# EAGLE schematic 15V Power Supply (EAGLE 9.1.1)
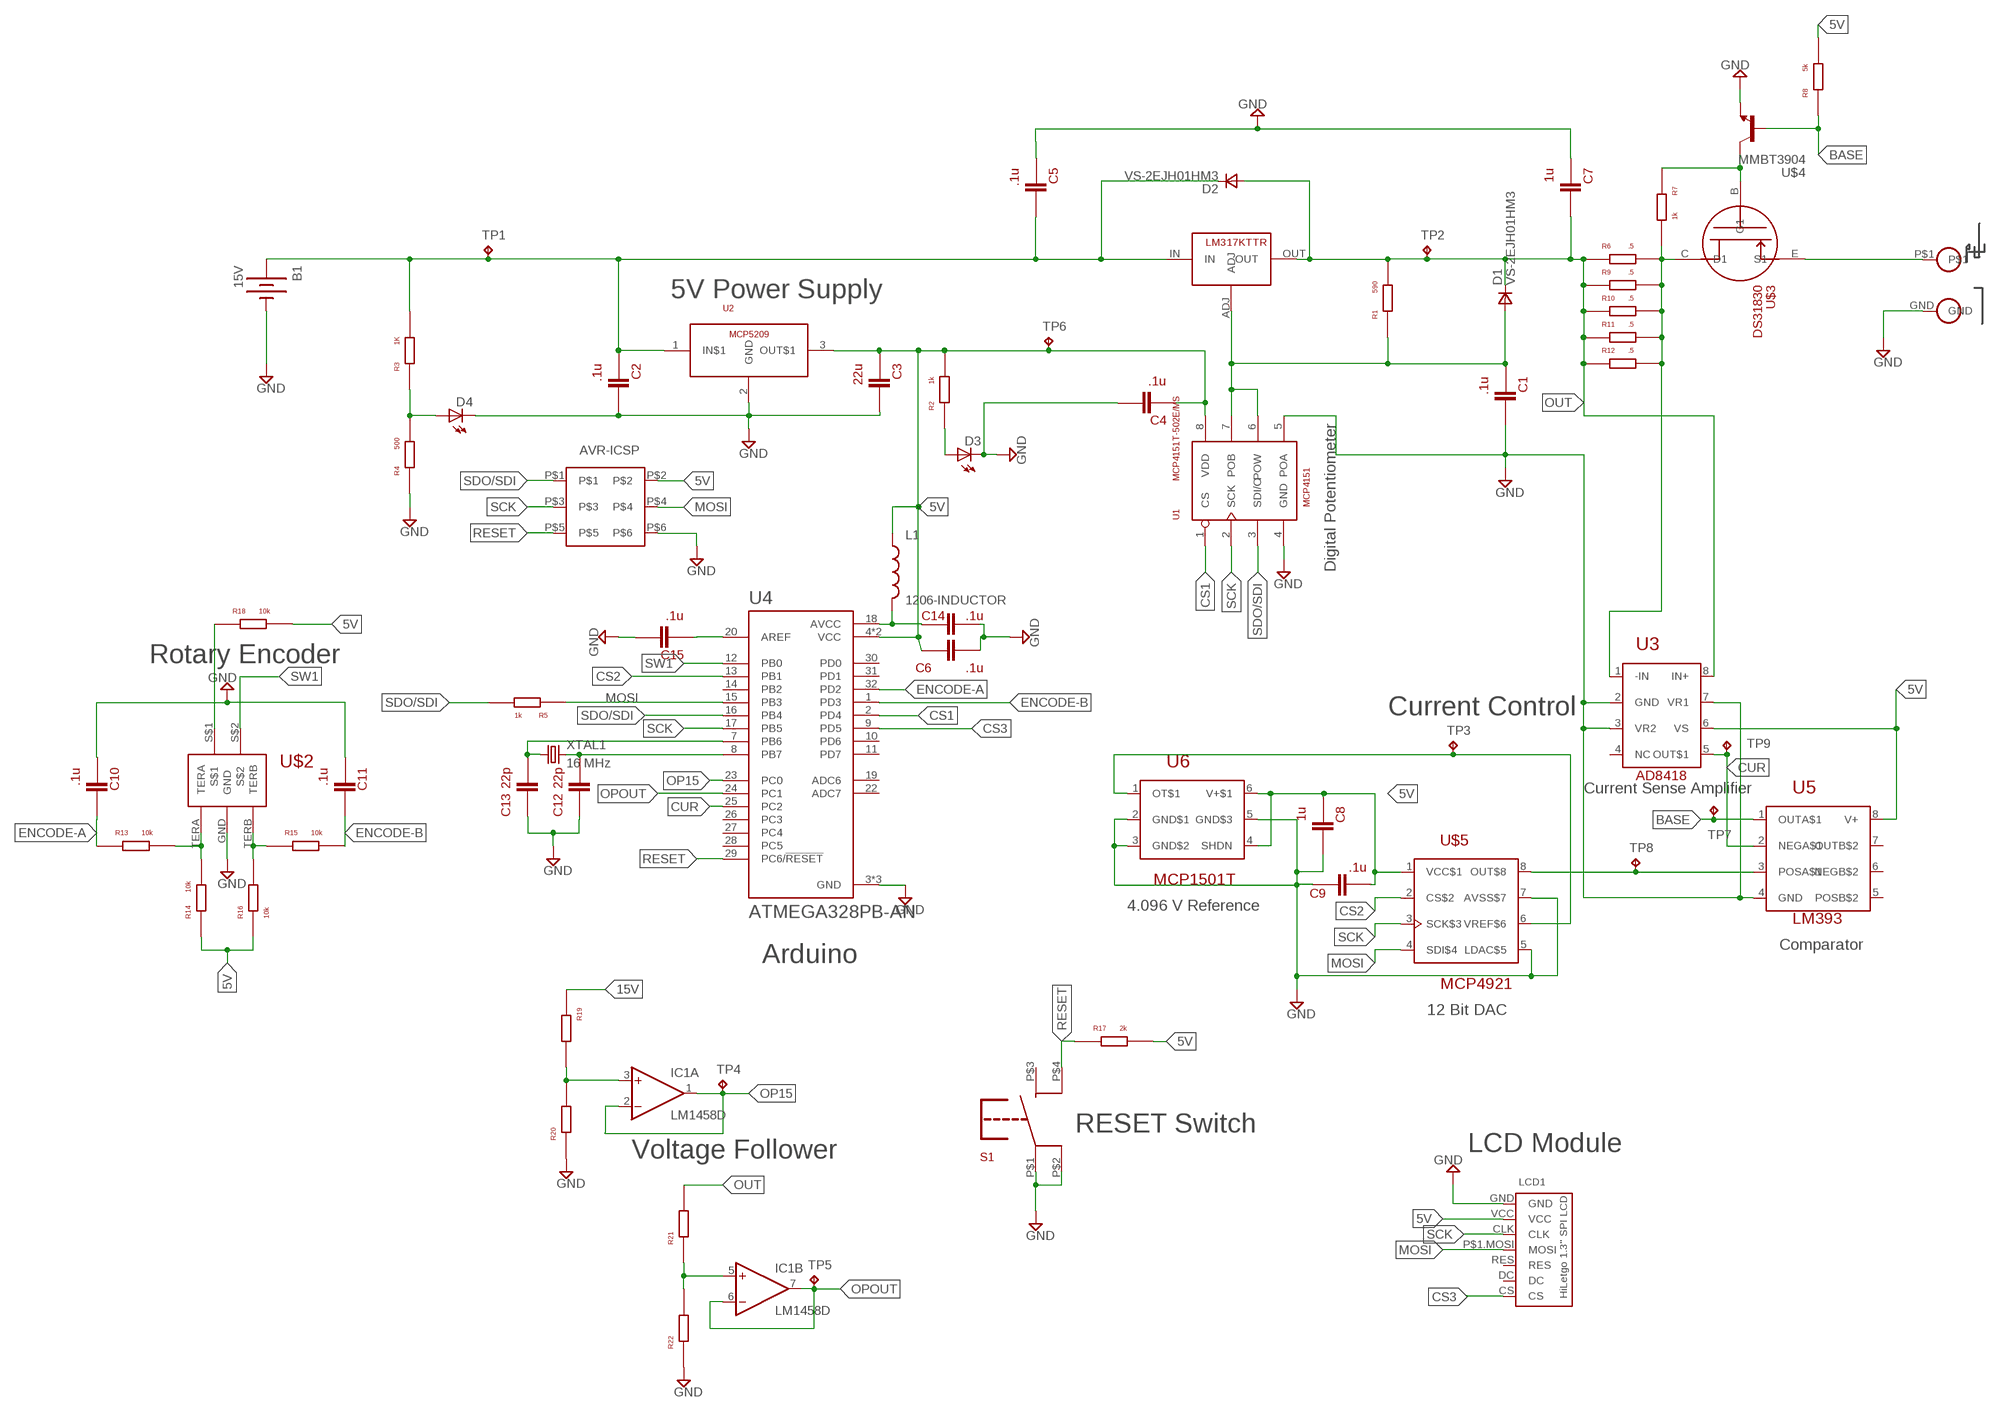
[diagram p0: schematic, sheet 1]

## Parts
B1  15V  2.1BARRELJACK  [2.1BARRELJACK]
C1  .1u  1206LED  [1206CAP]
C2  .1u  1206LED  [1206CAP]
C3  22u  1206LED  [1206CAP]
C4  .1u  1206LED  [1206CAP]
C5  .1u  1206LED  [1206CAP]
C6  .1u  1206LED  [1206CAP]
C7  1u  1206LED  [1206CAP]
C8  1u  1206LED  [1206CAP]
C9  .1u  1206LED  [1206CAP]
C10  .1u  1206LED  [1206CAP]
C11  .1u  1206LED  [1206CAP]
C12  22p  1206LED  [1206CAP]
C13  22p  1206LED  [1206CAP]
C14  .1u  1206LED  [1206CAP]
C15  .1u  1206LED  [1206CAP]
D1  VS-2EJH01HM3  [DO-221AC-2]
D2  VS-2EJH01HM3  [DO-221AC-2]
D3  1206LEDDIODE  [1206]
D4  1206LEDDIODE  [1206]
IC1  LM1458D  [SO08]
L1  1206-INDUCTOR  [1206]
LCD1  HILETGOSPILCD  [HILETGOSPILCD]
R1  590  1206RESISTOR  [1206]
R2  1k  1206RESISTOR  [1206]
R3  1K  1206RESISTOR  [1206]
R4  500  1206RESISTOR  [1206]
R5  1k  1206RESISTOR  [1206]
R6  .5  1206RESISTOR  [1206]
R7  1k  1206RESISTOR  [1206]
R8  5k  1206RESISTOR  [1206]
R9  .5  1206RESISTOR  [1206]
R10  .5  1206RESISTOR  [1206]
R11  .5  1206RESISTOR  [1206]
R12  .5  1206RESISTOR  [1206]
R13  10k  1206RESISTOR  [1206]
R14  10k  1206RESISTOR  [1206]
R15  10k  1206RESISTOR  [1206]
R16  10k  1206RESISTOR  [1206]
R17  2k  1206RESISTOR  [1206]
R18  10k  1206RESISTOR  [1206]
R19  1206RESISTOR  [1206]
R20  1206RESISTOR  [1206]
R21  1206RESISTOR  [1206]
R22  1206RESISTOR  [1206]
S1  TL3305  [TL3305]
TP1  TPTP11R  [TP11R]
TP2  TPTP11R  [TP11R]
TP3  TPTP11R  [TP11R]
TP4  TPTP11R  [TP11R]
TP5  TPTP11R  [TP11R]
TP6  TPTP11R  [TP11R]
TP7  TPPAD1-13  [P1-13]
TP8  TPB1,27  [B1,27]
TP9  TPB1,27  [B1,27]
U1  MCP4151T-502E/MS  [DGK_S-PDSO-G8]
U2  MCP5209-5.0YS  [SOT223]
U3  AD8418BZR  [DGK_S-PDSO-G8]
U4  ATMEGA328PB-AN  [QFP80P900X900X120-32N]
U5  LM393  [SO8]
U6  MCP1501T-40E/CHY  [SOT23-6]
U$1  LM317KTTR  [LM317KTTR]
U$2  PEC11R  [PEC11R-4]
U$3  DS31830  [SC59-EBC]
U$4  MMBT3904  [SC59-EBC]
U$5  MCP4921-E/SN  [SO8]
U$6  ICSP-HEADER  [ISCP-PORT]
U$7  BINDINGPOST  [CT2232]
XTAL1  16 MHz  16MHZ-CRYSTAL  [HC/49US]

## Nets
5V: C3.P$2 C4.P$2 C6.P$1 C8.P$2 C9.P$1 L1.P$1 LCD1.VCC R2.P$1 R8.P$1 R14.P$2 R16.P$2 R17.P$1 R18.P$1 TP6.TP U1.8(VDD) U2.3(OUT$1) U3.6(VS) U4.4(VCC) U4.6(VCC) U5.8(V+) U6.4(SHDN) U6.6(V+$1) U$5.1(VCC$1) U$6.P$2
15V: B1.POS C2.P$2 C5.P$1 D2.C$1(C) R3.P$1 R19.P$2 TP1.TP U2.1(IN$1) U$1.IN
BASE: R8.P$2 TP7.TP U5.1(OUTA$1) U$4.B
CS1: U1.1(CS) U4.2(PD4)
CS2: U4.13(PB1) U$5.2(CS$2)
CS3: LCD1.CS U4.9(PD5)
CUR: TP9.TP U3.5(OUT$1) U4.25(PC2) U5.2(NEGA$1)
ENCODE-A: C10.P$1 R13.P$2 U4.32(PD2)
ENCODE-B: C11.P$1 R15.P$1 U4.1(PD3)
GND: B1.GND$1(GND) C1.P$1 C2.P$1 C3.P$1 C4.P$1 C5.P$2 C6.P$2 C7.P$2 C8.P$1 C9.P$2 C10.P$2 C11.P$2 C12.P$1 C13.P$1 C14.P$2 C15.P$1 D3.P$2(C) D4.P$2(C) LCD1.GND R4.P$2 R20.P$2 R22.P$2 S1.P$1 S1.P$2 U1.4(GND) U1.5(POA) U2.2(GND) U3.2(GND) U3.3(VR2) U3.7(VR1) U4.3(GND) U4.5(GND) U4.21(GND) U5.4(GND) U6.2(GND$1) U6.3(GND$2) U6.5(GND$3) U$2.GND U$4.E U$5.5(LDAC$5) U$5.7(AVSS$7) U$6.P$6 U$7.GND
MOSI: LCD1.P$1.MOSI(MOSI) R5.P$2 U4.15(PB3) U$5.4(SDI$4) U$6.P$4
N$1: D4.P$1(A) R3.P$2 R4.P$1
N$2: U$3.E(S1) U$7.P$1
N$3: C1.P$2 D1.A$1(A) R1.P$2 U1.6(POW) U1.7(POB) U$1.ADJ
N$4: TP3.TP U6.1(OT$1) U$5.6(VREF$6)
N$6: D3.P$1(A) R2.P$2
N$7: C14.P$1 L1.P$2 U4.18(AVCC)
N$8: C13.P$2 U4.7(PB6) XTAL1.P$1
N$9: TP8.TP U5.3(POSA$1) U$5.8(OUT$8)
N$10: R6.P$1 R7.P$1 R9.P$1 R10.P$1 R11.P$1 R12.P$1 U3.1(-IN) U$3.C(D1)
N$11: R13.P$1 R14.P$1 U$2.TERA
N$12: R15.P$2 R16.P$1 U$2.TERB
N$13: C12.P$2 U4.8(PB7) XTAL1.P$2
N$14: R7.P$2 U$3.B(G1) U$4.C
N$16: C15.P$2 U4.20(AREF)
N$18: R18.P$2 U$2.S$1
N$20: IC1.3(A:+IN) R19.P$1 R20.P$1
N$22: IC1.5(B:+IN) R21.P$2 R22.P$1
OP15: IC1.1(A:OUT) IC1.2(A:-IN) TP4.TP U4.23(PC0)
OPOUT: IC1.6(B:-IN) IC1.7(B:OUT) TP5.TP U4.24(PC1)
OUT: C7.P$1 D1.C$1(C) D2.A$1(A) R1.P$1 R6.P$2 R9.P$2 R10.P$2 R11.P$2 R12.P$2 R21.P$1 TP2.TP U3.8(IN+) U$1.OUT
RESET: R17.P$2 S1.P$4 U4.29(PC6/!RESET) U$6.P$5
SCK: LCD1.CLK U1.2(SCK) U4.17(PB5) U$5.3(SCK$3) U$6.P$3
SDO/SDI: R5.P$1 U1.3(SDI/O) U4.16(PB4) U$6.P$1
SW1: U4.12(PB0) U$2.S$2
Unconnected: LCD1.DC LCD1.RES S1.P$3 U3.4(NC) U4.10(PD6) U4.11(PD7) U4.14(PB2) U4.19(ADC6) U4.22(ADC7) U4.26(PC3) U4.27(PC4) U4.28(PC5) U4.30(PD0) U4.31(PD1) U5.5(POSB$2) U5.6(NEGB$2) U5.7(OUTB$2)

## Notes on the sheet
- 5V Power Supply
- Digital Potentiometer
- Rotary Encoder
- Current Control
- Current Sense Amplifier
- 4.096 V Reference
- Comparator
- Arduino
- 12 Bit DAC
- RESET Switch
- Voltage Follower | LCD Module

## Power pins joined to a net without a drawn wire
V+: IC1.8(P:V+)
V-: IC1.4(P:V-)

## Library data of the parts
B1 = Booster Parts:2.1BARRELJACK: 2.1 mm x 5.5 mm Barrel Jack Specifications: Manufacturer: Memory Protection Devices Voltage - Rated: 12 VDC Current Rating: 5A Datasheet: EJ508A <http://www.memoryprotectiondevices.com/datasheets/EJ508A-datasheet.pdf> Digikey Part #: EJ508A-ND <https://www.digikey.com/products/en?keywords=EJ508A>
C1-C15 = 1206CAP:1206LED
D1 D2 = LM317:VS-2EJH01HM3: Vishay VS-3EJH01HM3/6A: 100V 3A Diode Specifications: Manufacturer: Vishay Package: DO-221AC-2 Forward Voltage: 860 mV Forward Current: 3A Reverse Voltage: 100V Datasheet: VS-3EJH01HM3 <https://www.mouser.com/datasheet/2/427/vs-3ejh01hm3-536040.pdf> Mouser Part#: 78-VS-3EJH01HM3/6A <https://www.mouser.com/ProductDetail/Vishay-Semiconductors/VS-3EJH01HM3-6A?qs=sGAEpiMZZMtbRapU8LlZD2SeOtOF9X2ALsiyNn0CLQRcwM3bCh42Ug%3d%3d>
D3 D4 = 1206LED:1206LED
IC1 = linear:*1458: OP AMP
L1 = ATMEGA328PB-AN:1206-INDUCTOR: 1206 Inductor
LCD1 = ATMEGA328PB-AN:HILETGOSPILCD: HiLetgo 1.3" SPI LCD Specifications: Website: Amazon <https://www.amazon.com/HiLetgo-128x64-SSH1106-Display-Arduino/dp/B01N1LZT8L/ref=sr_1_7?ie=UTF8&qid=1531415847&sr=8-7&keywords=spi+display>
R1-R22 = 1206 Resistor:1206RESISTOR: Bourns CR1206 - 1206 Resistor Manufacturer: Bourns Series: CR1206 Power Rating: 250 mW Tolerance: 1% Mouser: CR1206 <https://www.mouser.com/ProductDetail/Bourns/CR1206-FX-6801ELF?qs=sGAEpiMZZMtlubZbdhIBIK83tcUYgy7Iyiq0v%2f0IFwE%3d>
S1 = ATMEGA328PB-AN:TL3305: TL3305: Momentary SPST Switch Specifications: Circuit: SPST-NO Mounting Type: Surface Mount Datasheet: TL3305 <http://spec_sheets.e-switch.com/specs/P010468.pdf> Digi-Key Part #: EG5350CT-ND <https://www.digikey.com/product-detail/en/e-switch/TL3305AF160QG/EG5350TR-ND/5816181>
TP1-TP9 = testpad:TP: Test pad
U1 = LM317:MCP4151T-502E/MS: Microchip MCP4151T-502E/MS: 5K Digital Potentiometer-SPI Specifications: Manufacturer: Microchip VDD Operating Range: 1.8-5.5V Maximum Current into Pot: 2.5mA Resistance: 5K Communication Scheme: SPI Resistor Network Resolution: 256 Datasheet: MCP4151T-502E/MS <https://www.mouser.com/datasheet/2/268/22060a-53835.pdf> Mouser Part#: 579-MCP4151T-502E/MS <https://www.mouser.com/ProductDetail/Microchip-Technology/MCP4151T-502E-MS?qs=sGAEpiMZZMuD%2f7PTYBwKqfDph4xMc6S2Pj2Nsus7uv8%3d>
U2 = ATMEGA328PB-AN:MCP5209-5.0YS: Microchip MCP5209-5.0YS: 5V Linear Regulator Specifications: Manufacturer: Microchip Technology Voltage - Input (Max): 16V Output Voltage: 5V Output Current: 500 mA Voltage Dropout: .6V Datasheet: MCP5209-5.0YS <http://ww1.microchip.com/downloads/en/DeviceDoc/20005720A.pdf> Digi-Key Part#: 576-1276-ND <https://www.digikey.com/product-detail/en/microchip-technology/MIC5209-5.0YS/576-1276-ND/771745>
U3 = ATMEGA328PB-AN:AD8418BZR
U4 = ATMEGA328PB-AN:ATMEGA328PB-AN: ATmega Series 20 MHz 32 KB Flash 2 KB SRAM 8-Bit Microcontroller - TQFP-32; AVAILABILITY: Good; DESCRIPTION: AVR microcontroller; EEPROM: 1024B; SRAM: 2kB; Flash: 32kB; TQFP32; MF: Microchip; MP: ATMEGA328PB-AN; PACKAGE: TQFP-32 Microchip; PRICE: 1.36 USD
U5 = ATMEGA328PB-AN:LM393: LM393: Dual Comparator
U6 = ATMEGA328PB-AN:MCP1501T-40E/CHY: MCP1501: 4.096 Voltage Reference Specifications Manufacture: Microchip Package: SOT-23-6 Output Voltage: 4.096 V Max Input Voltage: 5.5 V Datasheet: MCP1501 <https://www.mouser.com/datasheet/2/268/20005474C-961722.pdf> Mouser Part #: 579-MCP1501T-40E/CHY <https://www.mouser.com/ProductDetail/579-MCP1501T-40E-CHY>
U$1 = LM317:LM317KTTR: LM317KTTR: 1.25V - 37V Linear Regulator Specifications: Manufacturer: Texas Instruments Package: TO-263-3 Output Type: Adjustable Output Current: 1.5A Datasheet: LM317 <http://www.ti.com/lit/ds/symlink/lm317.pdf> Mouser Part#: 595-LM317KTTR <https://www.mouser.com/ProductDetail/Texas-Instruments/LM317KTTR?qs=sGAEpiMZZMtUqDgmOWBjgHdj12KM6gWGA4eYhLYAhQc%3d>
U$2 = ATMEGA328PB-AN:PEC11R: Bourns PEC11R-4215F-S0024: Rotary Encoder Specifications: Datasheet: PEC11R-4215F-S0024 <https://www.mouser.com/datasheet/2/54/EC11R-777457.pdf> Mouser Part#: 652-PEC11R-4215F-S24 <https://www.mouser.com/ProductDetail/652-PEC11R-4215F-S24>
U$3 = LM317:DS31830: DMP2035U-7: PMOS Transistor Specifications: Manufacturer: Diode Incorporated FET Type: P-Channel Vdss: 20V Drive Voltage: 1.8V, 4.5V Power (Max): 810 mW Datasheet: DMP2035U-7 <https://www.diodes.com/assets/Datasheets/ds31830.pdf> Digi-Key Part#: DMP2032U-7DICT-ND <https://www.digikey.com/product-detail/en/diodes-incorporated/DMP2035U-7/DMP2035U-7DICT-ND/2181234>
U$4 = LM317:MMBT3904: MMBT3904: NPN Transistor Specifications: Manufacturer: Micro Commerical Components Package: SOT-23 Transistor Type: NPN Ic (Max): 200 mA VCE (Max): 40 V Power (Max): 350 mW Datasheet: MMBT3904 <http://www.mccsemi.com/up_pdf/MMBT3904(SOT-23).pdf> Digi-Key Part#: MMBT3904TPMSCT-ND <https://www.digikey.com/product-detail/en/micro-commercial-co/MMBT3904-TP/MMBT3904TPMSCT-ND/717395>
U$5 = ATMEGA328PB-AN:MCP4921-E/SN: MCP4921-E/SN: 12 Bit DAC
U$6 = ATMEGA328PB-AN:ICSP-HEADER: AVR-ICSP Header
U$7 = LM317:BINDINGPOST
XTAL1 = ATMEGA328PB-AN:16MHZ-CRYSTAL: Abracon LLC ABLS-16MHz-B4-T: Crystal Specifications Manufacturer: Abracon Frequency: 16MHz Frequency Stability: ±50 ppm Datasheet: ABLS Series Datasheet <https://abracon.com/Resonators/abls.pdf> Digi-Key Part #: 535-10226-2-ND <https://www.digikey.com/product-detail/en/abracon-llc/ABLS-16.000MHZ-B4-T/535-10226-2-ND/2184169>

## Module 15V_REGULATOR
Ports: 

### Library data of the parts